# Altium schematic sheet CC_EXP.SchDoc
size A4
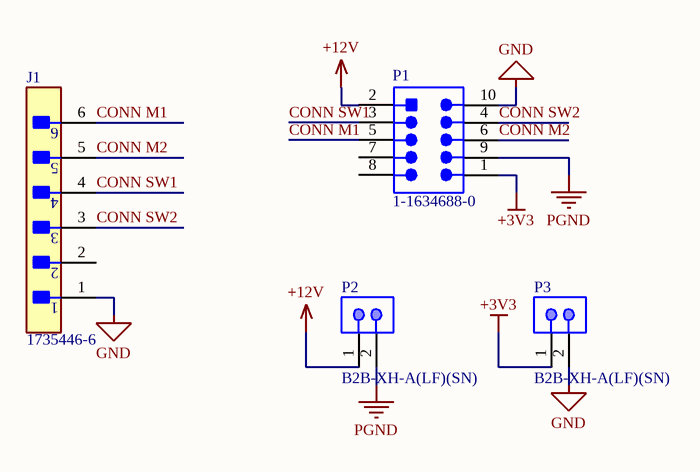
[diagram p0: CC_EXP.SchDoc]

## Parts
J1  1735446-6  [FP-1735446-6-MFG]
P1  1-1634688-0  [TECO-1-1634688-0-10_V]
P2  B2B-XH-A(LF)(SN)  [JST-B2B-XH-A_V]
P3  B2B-XH-A(LF)(SN)  [JST-B2B-XH-A_V]

## Nets
+3V3: P1.1 P3.1
+12V: P1.2 P2.1
GND: J1.1 P1.10 P3.2
PGND: P1.9 P2.2
CONN M1: J1.6 P1.5
CONN M2: J1.5 P1.6
CONN SW1: J1.4 P1.3
CONN SW2: J1.3 P1.4

Not connected (* = marked no-connect by the designer): J1 2; P1 7 8

## Library data of the parts
J1 = CMP-03369-000087-1: CONN HEADER VERT 6POS 2MM; Manufacturer: TE; Conn Gender: Male; Conn Orientation: Vertical; Current Rating: 3A; Voltage Rating: 100V; Number Of Contacts: 6; Device Class L1: Connectors; RoHS: TRUE; Pitch: 2mm; Number Of Rows: 1; Device Class L2: Headers and Wire Housings; Digikey Description: CONN HEADER VERT 6POS 2MM; Category: Conn; Automotive: No; Device Class L3: unset; Lead Free: Yes; Package: 1735446-6; Height: 6.37mm; Temperature: -25°C to +85°C; Contact Material: Tin,Nickel; Mouser Description: Headers & Wire Housings 6 POS HDR VERT 2.0mm; Octopart: https://octopart.com/1735446-6-te+connectivity-42205942; Temperature Range High: +85°C; ComponentLink2URL: https://www.te.com/usa-en/product-1735446-6.html; ComponentLink2Description: Datasheet; Temperature Range Low: -25°C; Manufacturer Part Number: 1735446-6
P1 = CMP-2000-05854-1: Male Header, Pitch 2.54 mm, 2 x 5 Postion, Height 9.15 mm, Tail Length 3.2 mm, -40 to 105 degC, RoHS, Bulk; Manufacturer: TE Connectivity; No. of Rows: 2; SVHC: ToBeAdvised; Package Version: Rev. C2, 02/2011; No. of Contacts: 10Contacts; Pitch: 2.54mm; No. of Positions: 10; Contact Termination Type: ThroughHole; Package Description: 10-Pin Connector, Body 20.35 x 8.7 mm, Pitch 2.54 mm; Orientation: Straight; Gender: Header; Mounting Technology: ThroughHole; Product Range: -; PartNumber: 1-1634688-0; Datasheet Version: Rev. C2, 02/2011; Contact Material: Brass; Package URL: https://datasheet.ciiva.com/6831/eng-cd-1634688-c2-6831201.pdf; Package Reference: 1-1634688-0; Pitch Spacing: 2.54mm; Contact Plating: GoldPlatedContacts; Manufacturer URL: http://www.te.com/; Datasheet URL: https://datasheet.ciiva.com/6831/eng-cd-1634688-c2-6831201.pdf
P2 P3 = CMP-2000-05888-1: Male Header, Pitch 2.5 mm, 1 x 2 Position, Height 7 mm, Tail Length 3.4 mm, -25 to 85 degC, RoHS, Bulk; Manufacturer: JST; No of Positions: 2; Pitch: 2.5mm; Style/Orientation: StraightHeader/Plug; Datasheet Version: 05/2016; Package Description: Male Header, Pitch 2.5 mm, 1 x 2 Position, Height 7 mm, Tail Length 3.4 mm; Package Reference: B2B-XH-A; Mounting Technology: ThroughHole; Type: ShroudedHeader; Datasheet URL: http://www.jst-mfg.com/product/pdf/eng/eXH.pdf; Manufacturer URL: http://www.jst.com/home2.html; Termination: Crimp